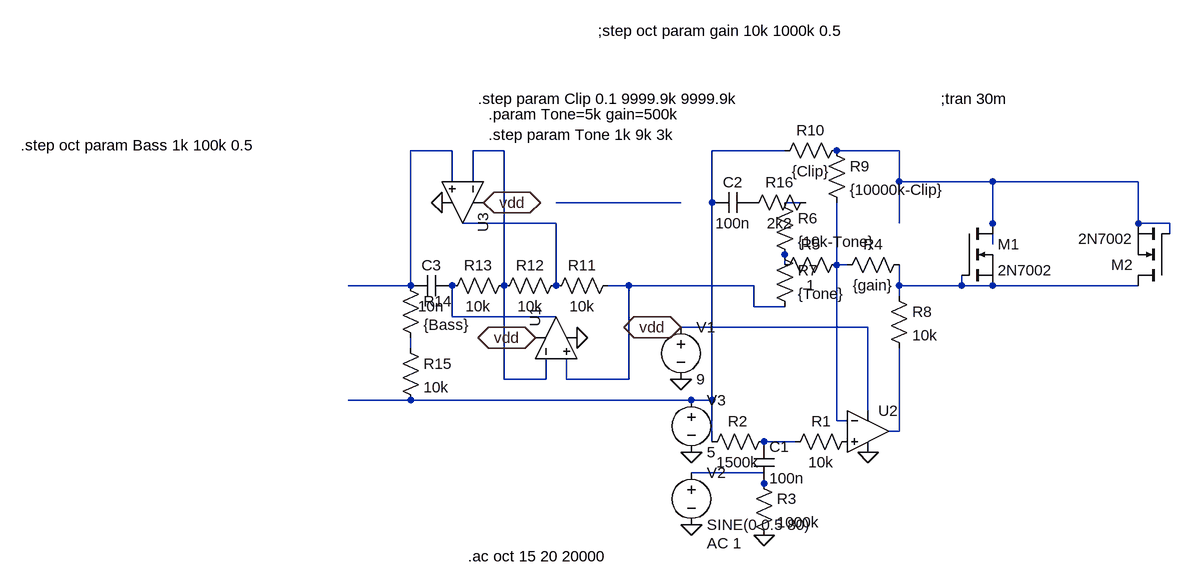
[diagram p0: schematic CoolODwithClipsw.asc]
CoolODwithClipsw.asc, the LTspice schematic file:
Version 4
SHEET 1 880 680
WIRE -448 -224 -512 -224
WIRE -368 -224 -416 -224
WIRE 64 -224 -48 -224
WIRE 240 -224 144 -224
WIRE -448 -176 -448 -224
WIRE -416 -176 -416 -224
WIRE 240 -176 240 -224
WIRE 384 -176 240 -176
WIRE 608 -176 384 -176
WIRE -96 -144 -288 -144
WIRE -48 -144 -48 -224
WIRE 96 -144 64 -144
WIRE -288 -112 -432 -112
WIRE 240 -112 240 -176
WIRE 384 -112 384 -176
WIRE 608 -112 608 -176
WIRE 656 -112 608 -112
WIRE 656 -96 656 -112
WIRE 384 -80 384 -112
WIRE 64 -48 64 -64
WIRE 144 -48 144 -144
WIRE 160 -48 144 -48
WIRE -512 -16 -512 -224
WIRE -512 -16 -608 -16
WIRE -368 -16 -368 -224
WIRE -288 -16 -288 -112
WIRE -176 -16 -208 -16
WIRE 16 -16 -176 -16
WIRE 240 -16 240 -48
WIRE 336 -16 336 -32
WIRE 336 -16 240 -16
WIRE 384 -16 336 -16
WIRE 608 -16 384 -16
WIRE 240 0 240 -16
WIRE 16 16 16 -16
WIRE 64 16 16 16
WIRE -448 32 -448 -16
WIRE -288 32 -448 32
WIRE 192 48 -96 48
WIRE -512 80 -512 64
WIRE -368 128 -368 -16
WIRE -304 128 -304 96
WIRE -304 128 -368 128
WIRE -272 128 -272 96
WIRE -176 128 -176 -16
WIRE -176 128 -272 128
WIRE -512 160 -608 160
WIRE -80 160 -512 160
WIRE -48 160 -48 -144
WIRE -48 160 -80 160
WIRE 192 176 192 48
WIRE 144 192 144 -48
WIRE 160 192 144 192
WIRE 240 208 240 80
WIRE 240 208 224 208
WIRE -48 224 -48 160
WIRE 80 224 32 224
WIRE 32 272 -80 272
WIRE 32 288 32 272
FLAG 192 240 0
FLAG -96 128 0
FLAG -80 240 0
FLAG -80 352 0
FLAG 32 368 0
FLAG -96 48 vdd
IOPIN -96 48 BiDir
FLAG -320 64 vdd
IOPIN -320 64 BiDir
FLAG -256 64 0
FLAG -400 -144 vdd
IOPIN -400 -144 BiDir
FLAG -464 -144 0
SYMBOL voltage -96 32 R0
WINDOW 123 0 0 Left 0
WINDOW 39 0 0 Left 0
SYMATTR InstName V1
SYMATTR Value 9
SYMBOL voltage -80 256 R0
WINDOW 123 24 124 Left 2
WINDOW 39 0 0 Left 0
SYMATTR Value2 AC 1
SYMATTR InstName V2
SYMATTR Value SINE(0 0.5 80)
SYMBOL voltage -80 144 R0
WINDOW 123 0 0 Left 0
WINDOW 39 0 0 Left 0
SYMATTR InstName V3
SYMATTR Value 5
SYMBOL cap 16 224 R0
SYMATTR InstName C1
SYMATTR Value 100n
SYMBOL res 176 208 R90
WINDOW 0 0 56 VBottom 2
WINDOW 3 32 56 VTop 2
SYMATTR InstName R1
SYMATTR Value 10k
SYMBOL res 48 208 R90
WINDOW 0 0 56 VBottom 2
WINDOW 3 32 56 VTop 2
SYMATTR InstName R2
SYMATTR Value 1500k
SYMBOL res 16 272 R0
SYMATTR InstName R3
SYMATTR Value 1000k
SYMBOL res 256 -64 R90
WINDOW 0 0 56 VBottom 2
WINDOW 3 32 56 VTop 2
SYMATTR InstName R4
SYMATTR Value {gain}
SYMBOL res 160 -64 R90
WINDOW 0 0 56 VBottom 2
WINDOW 3 32 56 VTop 2
SYMATTR InstName R5
SYMATTR Value 1
SYMBOL cap 16 -160 R90
WINDOW 0 0 32 VBottom 2
WINDOW 3 32 32 VTop 2
SYMATTR InstName C2
SYMATTR Value 100n
SYMBOL res 48 -160 R0
SYMATTR InstName R6
SYMATTR Value {10k-Tone}
SYMBOL res 48 -80 R0
SYMATTR InstName R7
SYMATTR Value {Tone}
SYMBOL res 224 -16 R0
SYMATTR InstName R8
SYMATTR Value 10k
SYMBOL Opamps\\UniversalOpamp2 192 208 R0
SYMATTR InstName U2
SYMBOL res 128 -240 R0
SYMATTR InstName R9
SYMATTR Value {10000k-Clip}
SYMBOL res 160 -240 R90
WINDOW 0 0 56 VBottom 2
WINDOW 3 32 56 VTop 2
SYMATTR InstName R10
SYMATTR Value {Clip}
SYMBOL nmos 336 -112 R0
SYMATTR InstName M1
SYMATTR Value 2N7002
SYMBOL nmos 656 -16 R180
SYMATTR InstName M2
SYMATTR Value 2N7002
SYMBOL Opamps\\UniversalOpamp2 -288 64 R270
SYMATTR InstName U1
SYMBOL res -192 -32 R90
WINDOW 0 0 56 VBottom 2
WINDOW 3 32 56 VTop 2
SYMATTR InstName R11
SYMATTR Value 10k
SYMBOL res -272 -32 R90
WINDOW 0 0 56 VBottom 2
WINDOW 3 32 56 VTop 2
SYMATTR InstName R12
SYMATTR Value 10k
SYMBOL res -352 -32 R90
WINDOW 0 0 56 VBottom 2
WINDOW 3 32 56 VTop 2
SYMATTR InstName R13
SYMATTR Value 10k
SYMBOL cap -448 -32 R90
WINDOW 0 0 32 VBottom 2
WINDOW 3 32 32 VTop 2
SYMATTR InstName C3
SYMATTR Value 10n
SYMBOL res -528 -32 R0
SYMATTR InstName R14
SYMATTR Value {Bass}
SYMBOL Opamps\\UniversalOpamp2 -432 -144 R90
SYMATTR InstName U3
SYMBOL res -528 64 R0
SYMATTR InstName R15
SYMATTR Value 10k
SYMBOL res 112 -160 R90
WINDOW 0 0 56 VBottom 2
WINDOW 3 32 56 VTop 2
SYMATTR InstName R16
SYMATTR Value 2k2
TEXT -392 -248 Left 2 !.step param Tone 1k 9k 3k
TEXT -424 400 Left 2 !.ac oct 15 20 20000
TEXT 304 -304 Left 2 !;tran 30m
TEXT -224 -408 Left 2 !;step oct param gain 10k 1000k 0.5
TEXT -392 -280 Left 2 !.param Tone=5k gain=500k
TEXT -408 -304 Left 2 !.step param Clip 0.1 9999.9k 9999.9k
TEXT -1112 -232 Left 2 !.step oct param Bass 1k 100k 0.5

The netlist it stands for:
* CoolODwithClipsw.asc
V1 vdd 0 9
V2 N016 0 SINE(0 0.5 80) AC 1
V3 N003 0 5
C1 N015 N016 100n
R1 P001 N015 10k
R2 N015 N003 1500k
R3 N016 0 1000k
R4 N011 N009 {gain}
R5 N009 N008 1
C2 P002 N003 100n
R6 N006 N008 {10k-Tone}
R7 N008 N010 {Tone}
R8 N011 N014 10k
XU2 P001 N009 vdd 0 N014 level.2 Avol=1Meg GBW=10Meg Slew=10Meg ilimit=25m rail=0 Vos=0 phimargin=45 en=0 enk=0 in=0 ink=0 Rin=500Meg  ; pins IN+ IN- V+ V- OUT
R9 N004 N009 {10000k-Clip}
R10 N004 N003 {Clip}
M1 N004 N011 N011 N011 2N7002
M2 N011 N004 N004 N004 2N7002
XU1 N010 N002 vdd 0 N012 level.2 Avol=1Meg GBW=10Meg Slew=10Meg ilimit=25m rail=0 Vos=0 phimargin=45 en=0 enk=0 in=0 ink=0 Rin=500Meg  ; pins IN+ IN- V+ V- OUT
R11 N010 N007 10k
R12 N007 N002 10k
R13 N002 N012 10k
C3 N012 N001 10n
R14 N001 N013 {Bass}
XU3 N001 N002 vdd 0 N007 level.2 Avol=1Meg GBW=10Meg Slew=10Meg ilimit=25m rail=0 Vos=0 phimargin=45 en=0 enk=0 in=0 ink=0 Rin=500Meg  ; pins IN+ IN- V+ V- OUT
R15 N013 N003 10k
R16 N006 P002 2k2
.model NMOS NMOS
.model PMOS PMOS
.lib standard.mos
.step param Tone 1k 9k 3k
.ac oct 15 20 20000
;tran 30m
;step oct param gain 10k 1000k 0.5
.param Tone=5k gain=500k
.step param Clip 0.1 9999.9k 9999.9k
.step oct param Bass 1k 100k 0.5
.lib UniversalOpamps2.sub
.backanno
.end